# EAGLE design artlight.cornhole (EAGLE 9.2.2)
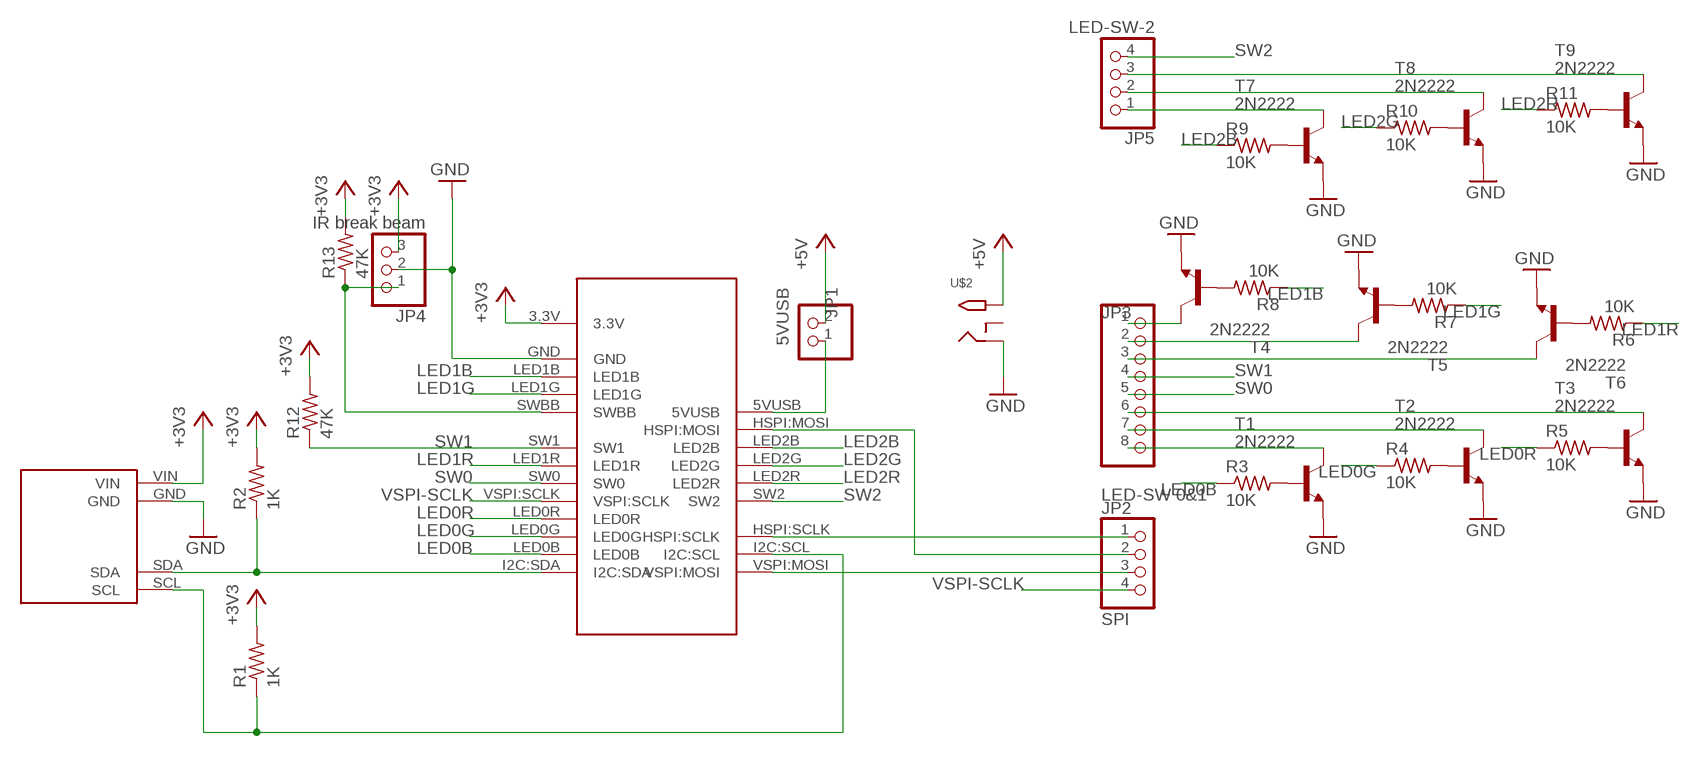
[diagram p0: schematic, sheet 1]

## Parts
JP1  5VUSB  PINHD-1X2  [1X02]
JP2  SPI  PINHD-1X4  [1X04]
JP3  LED-SW 0&1  PINHD-1X8  [1X08]
JP4  IR break beam  PINHD-1X3  [1X03]
JP5  LED-SW-2  PINHD-1X4  [1X04]
R1  1K  R-US_0204/7  [0204/7]
R2  1K  R-US_0204/7  [0204/7]
R3  10K  R-US_0204/2V  [0204V]
R4  10K  R-US_0204/2V  [0204V]
R5  10K  R-US_0204/2V  [0204V]
R6  10K  R-US_0204/2V  [0204V]
R7  10K  R-US_0204/2V  [0204V]
R8  10K  R-US_0204/2V  [0204V]
R9  10K  R-US_0204/2V  [0204V]
R10  10K  R-US_0204/2V  [0204V]
R11  10K  R-US_0204/2V  [0204V]
R12  47K  R-US_0204/7  [0204/7]
R13  47K  R-US_0204/7  [0204/7]
T1  2N2222  [TO92-EBC-OVAL]
T2  2N2222  [TO92-EBC-OVAL]
T3  2N2222  [TO92-EBC-OVAL]
T4  2N2222  [TO92-EBC-OVAL]
T5  2N2222  [TO92-EBC-OVAL]
T6  2N2222  [TO92-EBC-OVAL]
T7  2N2222  [TO92-EBC-OVAL]
T8  2N2222  [TO92-EBC-OVAL]
T9  2N2222  [TO92-EBC-OVAL]
U$1  HUZZAH32-ARTLIGHT.CORNHOLE  [FEATHERWING-ARTLIGHT.CORNHOLE]
U$2  2.1MMJACKTHM  [PJ-102A]
U$3  TSL2561-ARTLIGHT  [TSL2561-ARTLIGHT]

## Nets
5VUSB [power]: JP1.1 U$1.5VUSB
+3V3: JP4.3 R1.2 R2.2 R12.2 R13.2 U$1.3.3V U$3.VIN
+5V [power]: JP1.2 U$2.TIP
GND [ground]: JP4.2 T1.E T2.E T3.E T4.E T5.E T6.E T7.E T8.E T9.E U$1.GND U$2.RING U$3.GND
HSPI-MOSI: JP2.2 U$1.HSPI:MOSI
HSPI-SCLK: JP2.1 U$1.HSPI:SCLK
I2C-SCL: R1.1 U$1.I2C:SCL U$3.SCL
I2C-SDA: R2.1 U$1.I2C:SDA U$3.SDA
LED0B: R3.1 U$1.LED0B
LED0B-BASE: R3.2 T1.B
LED0B-PIN: JP3.8 T1.C
LED0G: R4.1 U$1.LED0G
LED0G-BASE: R4.2 T2.B
LED0G-PIN: JP3.7 T2.C
LED0R: R5.1 U$1.LED0R
LED0R-BASE: R5.2 T3.B
LED0R-PIN: JP3.6 T3.C
LED1B: R8.1 U$1.LED1B
LED1B-BASE: R8.2 T4.B
LED1B-PIN: JP3.1 T4.C
LED1G: R7.1 U$1.LED1G
LED1G-BASE: R7.2 T5.B
LED1G-PIN: JP3.2 T5.C
LED1R: R6.1 U$1.LED1R
LED1R-BASE: R6.2 T6.B
LED1R-PIN: JP3.3 T6.C
LED2B: R9.1 U$1.LED2B
LED2B-BASE: R9.2 T7.B
LED2B-PIN: JP5.1 T7.C
LED2G: R10.1 U$1.LED2G
LED2G-BASE: R10.2 T8.B
LED2G-PIN: JP5.2 T8.C
LED2R: R11.1 U$1.LED2R
LED2R-BASE: R11.2 T9.B
LED2R-PIN: JP5.3 T9.C
SW0: JP3.5 U$1.SW0
SW1: JP3.4 R12.1 U$1.SW1
SW2: JP5.4 U$1.SW2
SWBB: JP4.1 R13.1 U$1.SWBB
VSPI-MOSI: JP2.3 U$1.VSPI:MOSI
VSPI-SCLK: JP2.4 U$1.VSPI:SCLK
Unconnected: U$2.RING_SW

## Library data of the parts
JP1 = pinhead:PINHD-1X2: PIN HEADER
JP2 JP5 = pinhead:PINHD-1X4: PIN HEADER
JP3 = pinhead:PINHD-1X8: PIN HEADER
JP4 = pinhead:PINHD-1X3: PIN HEADER
R1-R13 = rcl:R-US_: RESISTOR, American symbol; SPICEPREFIX: R
T1-T9 = adafruit:2N2222: NPN TRANSISTOR Big oval pads
U$1 = artlight:HUZZAH32-ARTLIGHT.CORNHOLE: Adafruit Huzzah32 as used by artlight.cornhole
U$2 = adafruit:2.1MMJACK: 2.1mm x 5.5mm THM DC jack with internal switch. Digikey part #PJ-102A, 4UCON part #05537 2.1mm x 5.5mm SMT DC jack with internal switch. Digikey part #PJ-002A-SMT, 4UCON part #03267 By microbuilder.eu & adafruit.com
U$3 = artlight:TSL2561-ARTLIGHT: Adafruit TSL2561 as used by artlight

## Net classes
0 default: width 0.508 mm
2 power: width 1.27 mm

## Board
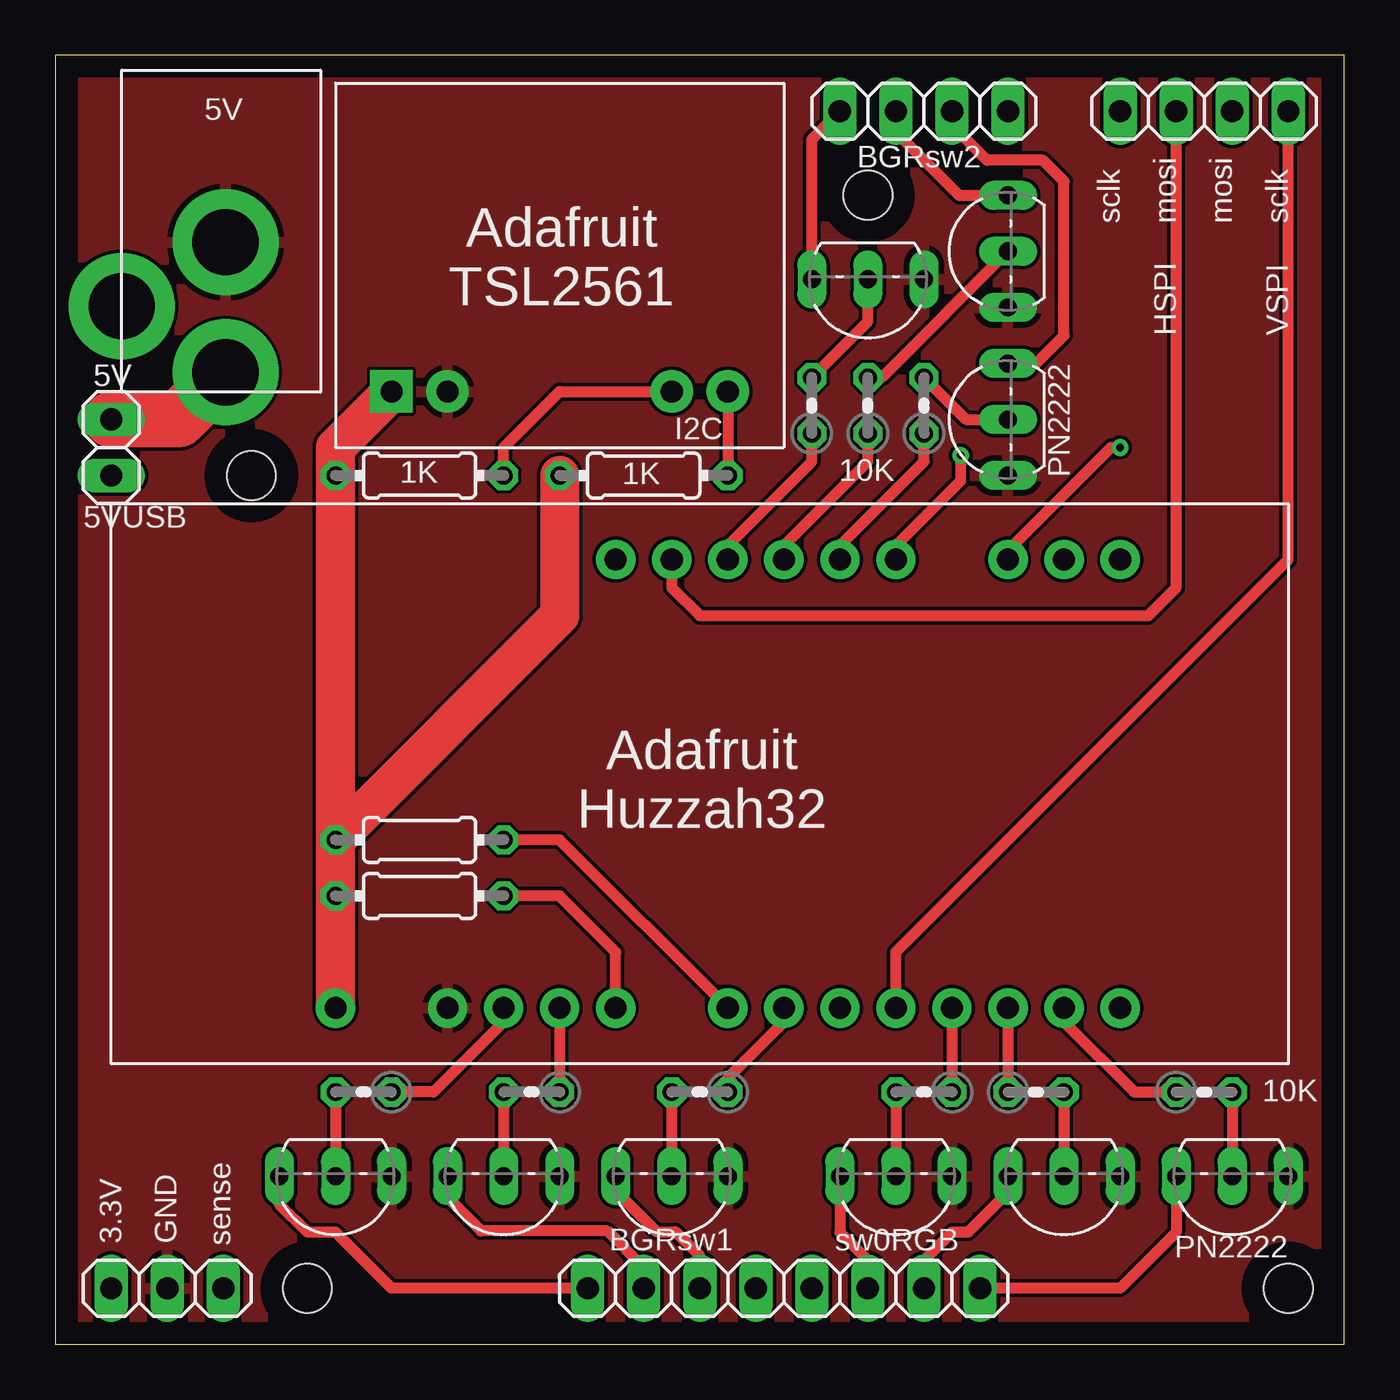
[diagram p1: board, top side]
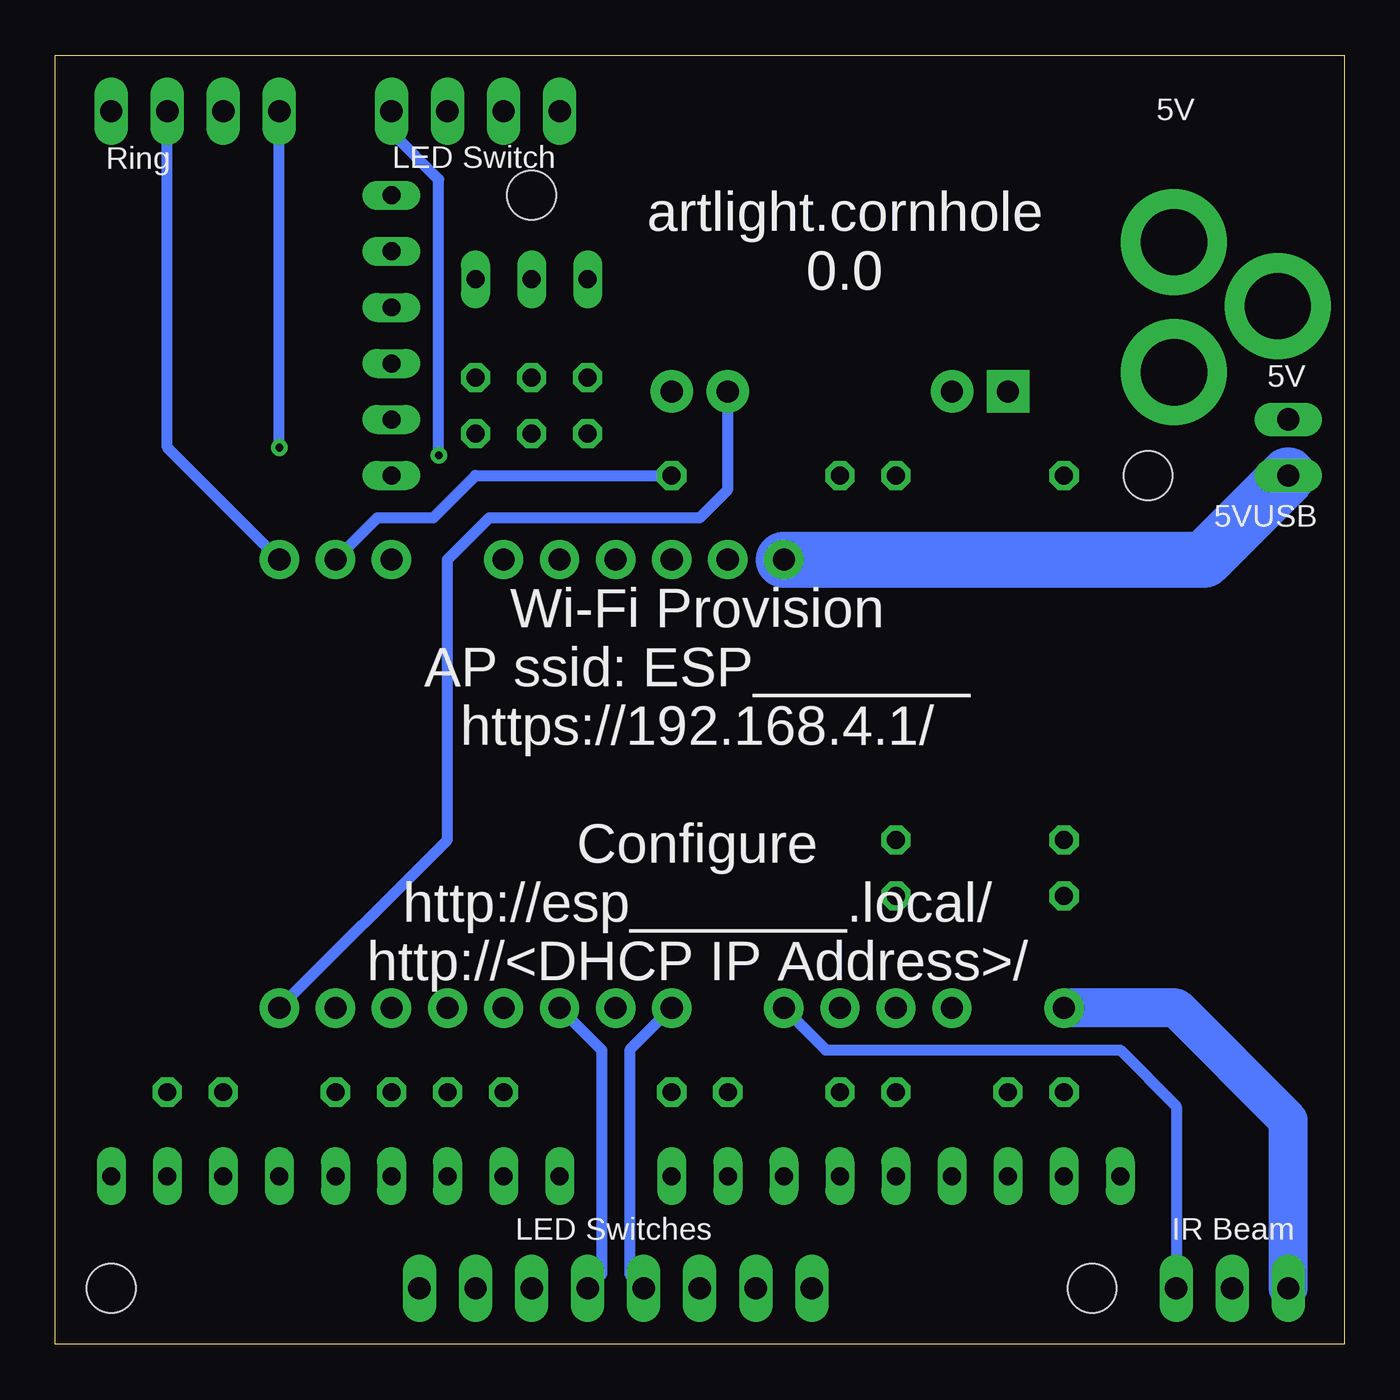
[diagram p2: board, bottom side, seen from below]

Size 58.42 x 58.42 mm. Coordinates in mm from the lower left corner, seen from the top.
Outline: 0,0 58.42,0 58.42,58.42 0,58.42 0,0
Copper layers (1*16): Top 0.035mm / dielectric 1.5mm / Bottom 0.035mm
Design rules "default": minimum track width 6mil, minimum drill 0.35mm, track to track 6mil, track to pad 6mil, pad to pad 6mil, via to via 6mil, smd to smd 6mil, copper to edge 40mil, drill to drill 6mil, minimum pad ring 10mil, minimum via ring 8mil, stop-mask expansion 4mil, vias tented up to drill 0mil, thermal gap 10mil
Holes 2.2 mm at 55.88,2.54 11.43,2.54 36.83,52.07 8.89,39.37

### Footprints (pad centres in the part's own frame; a part is rotated, then mirrored left to right if it is on the bottom)
1X02 = drill 1.016 long: 1 -1.27,0; 2 1.27,0
1X04 = drill 1.016 long: 1 -3.81,0; 2 -1.27,0; 3 1.27,0; 4 3.81,0
1X08 = drill 1.016 long: 1 -8.89,0; 2 -6.35,0; 3 -3.81,0; 4 -1.27,0; 5 1.27,0; 6 3.81,0; 7 6.35,0; 8 8.89,0
1X03 = drill 1.016 long: 1 -2.54,0; 2 0,0; 3 2.54,0
0204/7 = drill 0.813 octagon: 1 -3.81,0; 2 3.81,0
0204V = drill 0.813 octagon: 1 -1.27,0; 2 1.27,0
TO92-EBC-OVAL = drill 0.813 long: B 0,-1.27; C 2.54,-1.27; E -2.54,-1.27
FEATHERWING-ARTLIGHT.CORNHOLE = drill 1 pad 1.778: 3.3V -17.78,-10.16; 5VUSB -5.08,10.16; GND -12.7,-10.16; HSPI:MOSI -2.54,10.16; HSPI:SCLK 12.7,10.16; I2C:SCL 15.24,10.16; I2C:SDA 17.78,-10.16; LED0B 15.24,-10.16; LED0G 12.7,-10.16; LED0R 10.16,-10.16; LED1B -10.16,-10.16; LED1G -7.62,-10.16; LED1R 2.54,-10.16; LED2B 0,10.16; LED2G 2.54,10.16; LED2R 5.08,10.16; SW0 5.08,-10.16; SW1 0,-10.16; SW2 7.62,10.16; SWBB -5.08,-10.16; VSPI:MOSI 17.78,10.16; VSPI:SCLK 7.62,-10.16
PJ-102A = drill 3 pad 4.8: RING 0.1,-3.39; RING_SW -4.6,-6.29; TIP 0.1,-9.29
TSL2561-ARTLIGHT = drill 1 pad 1.93: GND -5.08,-5.08; SCL 7.62,-5.08; SDA 5.08,-5.08 | drill 1 pad 1.93 square: VIN -7.62,-5.08

### Placement (x,y rotation side)
JP1  2.54,40.64 90 top
JP2  52.07,55.88 0 top
JP3  33.02,2.54 0 top
JP4  5.08,2.54 180 top
JP5  39.37,55.88 0 top
R1  26.67,39.37 180 top
R2  16.51,39.37 180 top
R3  52.07,11.43 0 top
R4  44.45,11.43 0 top
R5  39.37,11.43 180 top
R6  29.21,11.43 180 top
R7  21.59,11.43 180 top
R8  13.97,11.43 180 top
R9  34.29,42.55 90 top
R10  36.83,42.55 90 top
R11  39.37,42.55 90 top
R12  16.51,22.86 180 top
R13  16.51,20.32 180 top
T1  53.34,6.35 180 top
T2  45.72,6.35 180 top
T3  38.1,6.35 180 top
T4  12.7,6.35 180 top
T5  20.32,6.35 180 top
T6  27.94,6.35 180 top
T7  36.83,46.99 180 top
T8  41.91,49.53 90 top
T9  41.91,41.91 90 top
U$1  30.48,25.4 0 top
U$2  7.62,53.34 0 top
U$3  22.86,48.26 0 top

### Tracks (layer width: path | path; a pad name or v marks a point on that pad's centre or on a via)
5VUSB
  Bottom 2.54: JP1.1 6.35,35.56 U$1.5VUSB
+3V3
  Top 1.778: U$1.3.3V R12.2 | U$3.VIN 12.7,40.64 R2.2 R12.2 | R1.2 22.86,33.02 R12.2 | R13.2 R12.2
  Bottom 1.778: JP4.3 2.54,10.16 7.62,15.24 U$1.3.3V
+5V
  Top 2.54: U$2.TIP 5.58,41.91 JP1.2
GND
  pour Top: 0,58.42 58.42,58.42 58.42,0 0,0
HSPI-MOSI
  Top 0.508: U$1.HSPI:MOSI 27.94,34.29 29.21,33.02 49.53,33.02 50.8,34.29 JP2.2
HSPI-SCLK  (via drill 0.35)
  Top 0.508: U$1.HSPI:SCLK 43.18,35.98 47.84,40.64 v48.26,40.64
  Bottom 0.508: v48.26,40.64 JP2.1
I2C-SCL
  Top 0.508: U$3.SCL R1.1
  Bottom 0.508: U$1.I2C:SCL 43.81,37.47 41.27,37.47 39.37,39.37 R1.1
I2C-SDA
  Top 0.508: R2.1 20.32,40.64 22.86,43.18 U$3.SDA
  Bottom 0.508: U$3.SDA 27.94,38.73 29.21,37.47 38.73,37.47 40.64,35.56 40.64,22.86 U$1.I2C:SDA
LED0B
  Top 0.508: U$1.LED0B 45.72,14.61 48.9,11.43 R3.1
LED0B-BASE
  Top 0.508: R3.2 T1.B
LED0B-PIN
  Top 0.508: T1.C 50.8,5.08 48.26,2.54 JP3.8
LED0G
  Top 0.508: U$1.LED0G R4.1
LED0G-BASE
  Top 0.508: R4.2 T2.B
LED0G-PIN
  Top 0.508: JP3.7 39.37,3.81 40.64,5.08 41.36,5.08 43.19,6.91 T2.C
LED0R
  Top 0.508: U$1.LED0R R5.1
LED0R-BASE
  Top 0.508: R5.2 T3.B
LED0R-PIN
  Top 0.508: T3.C 35.56,5.08 36.83,3.81 JP3.6
LED1B
  Top 0.508: U$1.LED1B 20.32,14.61 17.14,11.43 R8.1
LED1B-BASE
  Top 0.508: R8.2 T4.B
LED1B-PIN
  Top 0.508: JP3.1 15.24,2.54 12.7,5.08 11.43,5.08 10.16,6.35 T4.C
LED1G
  Top 0.508: U$1.LED1G R7.1
LED1G-BASE
  Top 0.508: R7.2 T5.B
LED1G-PIN
  Top 0.508: JP3.2 26.67,3.5 25.03,5.14 19.3,5.14 17.78,6.66 T5.C
LED1R
  Top 0.508: U$1.LED1R 33.02,14.61 30.48,12.06 R6.1
LED1R-BASE
  Top 0.508: R6.2 T6.B
LED1R-PIN
  Top 0.508: T6.C 25.4,6.96 27.25,5.11 28.11,5.11 29.21,4 JP3.3
LED2B
  Top 0.508: U$1.LED2B 30.48,36.2 34.29,40.01 R9.1
LED2B-BASE
  Top 0.508: R9.2 36.83,46.35 T7.B
LED2B-PIN
  Top 0.508: T7.C 34.29,54.61 JP5.1
LED2G
  Top 0.508: U$1.LED2G 33.02,36.2 36.83,40.01 R10.1
LED2G-BASE
  Top 0.508: T8.B 37.47,43.81 R10.2
LED2G-PIN
  Top 0.508: JP5.2 38.1,54.93 40.96,52.07 T8.C
LED2R
  Top 0.508: U$1.LED2R 35.56,36.2 39.37,40.01 R11.1
LED2R-BASE
  Top 0.508: R11.2 41.27,41.91 T9.B
LED2R-PIN
  Top 0.508: T9.C 44.45,44.45 45.72,45.72 45.72,52.7 44.77,53.66 42.23,53.66 40.64,55.24 JP5.3
SW0
  Bottom 0.508: U$1.SW0 33.66,13.34 33.66,3.17 JP3.5
SW1
  Top 0.508: U$1.SW1 22.86,22.86 R12.1
  Bottom 0.508: U$1.SW1 32.38,13.34 32.38,3.17 JP3.4
SW2  (via drill 0.35)
  Top 0.508: U$1.SW2 38.1,36.2 41.04,39.13 v41.04,40.29
  Bottom 0.508: v41.04,40.29 41.04,52.78 43.18,54.93 JP5.4
SWBB
  Top 0.508: U$1.SWBB 25.4,17.78 22.86,20.32 R13.1
  Bottom 0.508: U$1.SWBB 23.5,13.34 10.16,13.34 7.62,10.79 JP4.1
VSPI-MOSI
  Bottom 0.508: U$1.VSPI:MOSI 53.34,40.64 JP2.3
VSPI-SCLK
  Top 0.508: U$1.VSPI:SCLK 38.1,17.78 55.88,35.56 JP2.4

### Text on the board
tPlace: 5V | BGRsw2 | sclk | mosi | mosi | sclk | Adafruit / TSL2561 | HSPI | VSPI | 5V | I2C | 1K | 1K | 10K | PN2222 | 5VUSB | Adafruit / Huzzah32 | 10K | 3.3V | GND | sense | BGRsw1 | sw0RGB | PN2222
bPlace: 5V | LED Switch | Ring | artlight.cornhole / 0.0 | 5V | 5VUSB | Wi-Fi Provision / AP ssid: ESP_______ / https://192.168.4.1/ / / Configure / http://esp_______.local/ / http://<DHCP IP Address>/ | IR Beam | LED Switches